# Altium project Antarty.PrjPcb
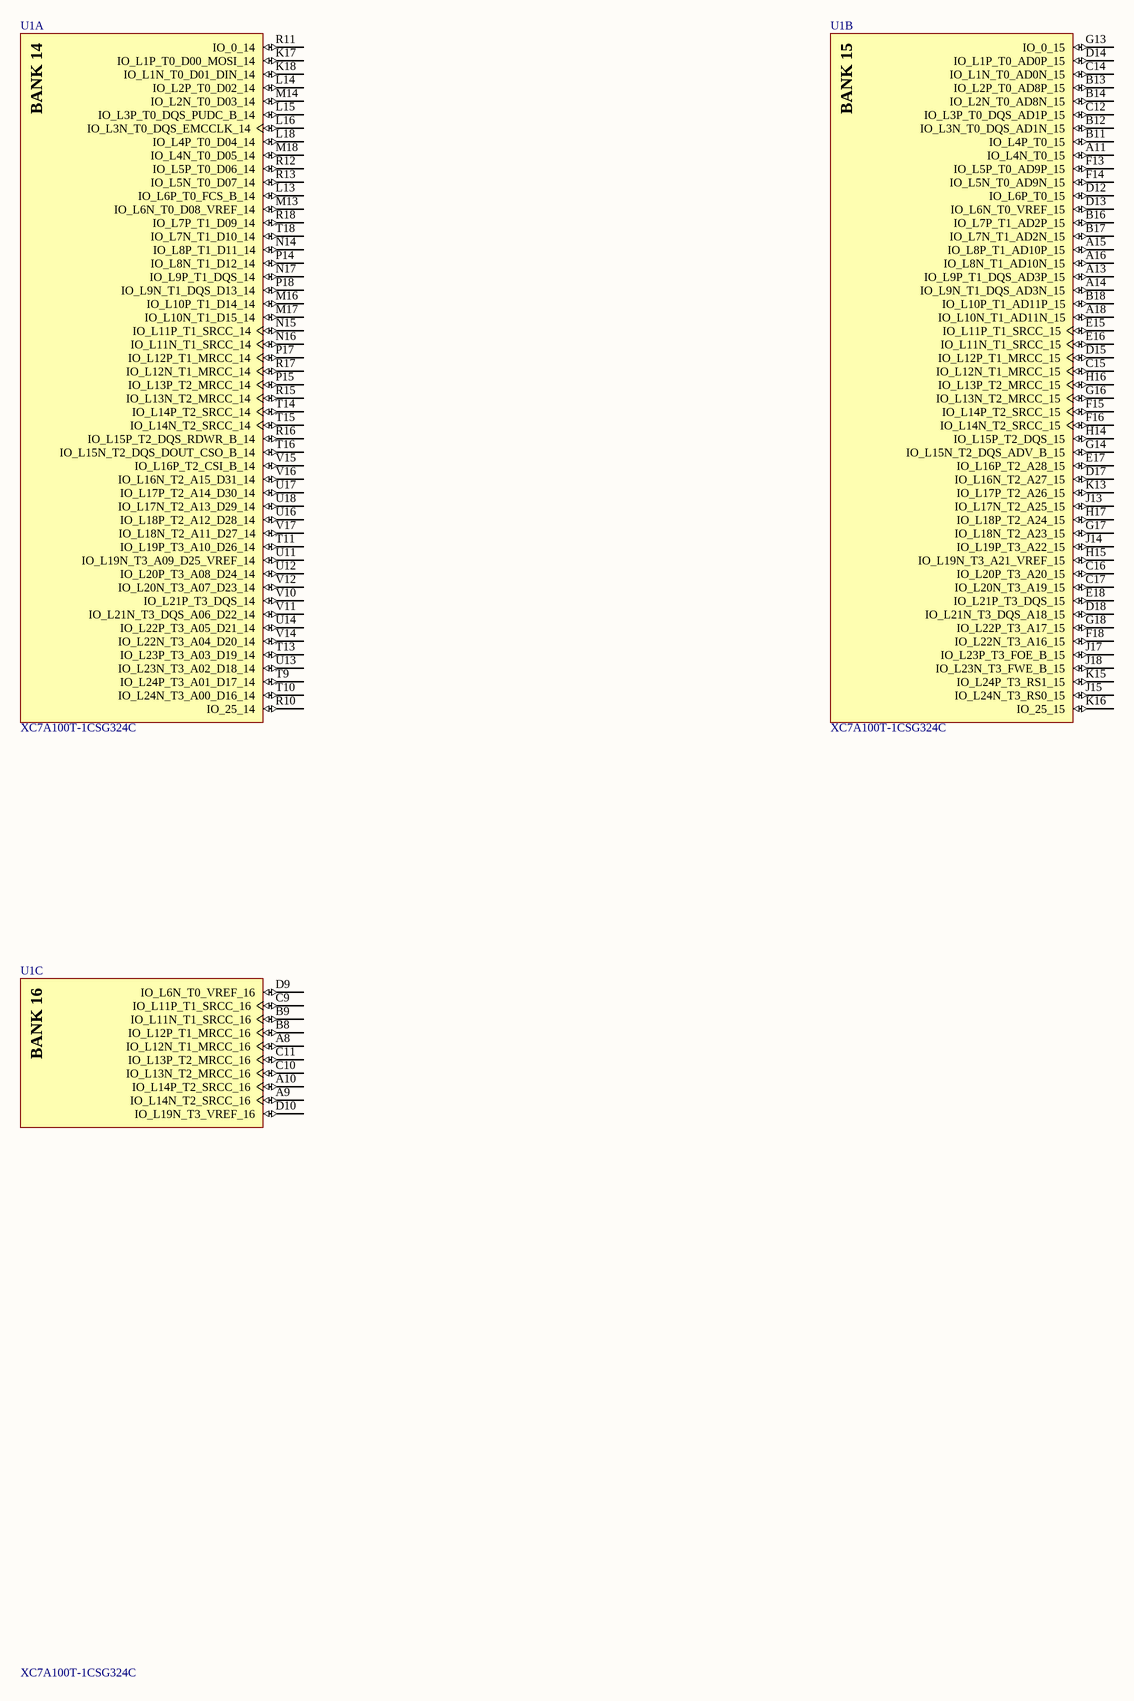
[diagram p0: Bank-1.SchDoc]
9 sheets, 1 parts. Net scope: global (net labels, ports and power ports of the same name join across sheets).
Board file: Board.PcbDoc
Sheets:
  Bank-1.SchDoc
  Bank-2.SchDoc
  Config-Flash.SchDoc
  Power.SchDoc
  Ethernet.SchDoc
  DDR3.SchDoc
  USB.SchDoc
  Power-Reg-1.SchDoc
  Power-Reg-2.SchDoc

## Sheet Bank-1.SchDoc: FPGA Banks
size A3; SheetNumber: 1; SheetTotal: 9

### Parts
U1  XC7A100T-1CSG324C  [CSG324]  (parts A,B,C of 9)

### Nets

Not connected (* = marked no-connect by the designer): U1 A8(IO_L12N_T1_MRCC_16) A9(IO_L14N_T2_SRCC_16) A10(IO_L14P_T2_SRCC_16) A11(IO_L4N_T0_15) A13(IO_L9P_T1_DQS_AD3P_15) A14(IO_L9N_T1_DQS_AD3N_15) A15(IO_L8P_T1_AD10P_15) A16(IO_L8N_T1_AD10N_15) A18(IO_L10N_T1_AD11N_15) B8(IO_L12P_T1_MRCC_16) B9(IO_L11N_T1_SRCC_16) B11(IO_L4P_T0_15) B12(IO_L3N_T0_DQS_AD1N_15) B13(IO_L2P_T0_AD8P_15) B14(IO_L2N_T0_AD8N_15) B16(IO_L7P_T1_AD2P_15) B17(IO_L7N_T1_AD2N_15) B18(IO_L10P_T1_AD11P_15) C9(IO_L11P_T1_SRCC_16) C10(IO_L13N_T2_MRCC_16) C11(IO_L13P_T2_MRCC_16) C12(IO_L3P_T0_DQS_AD1P_15) C14(IO_L1N_T0_AD0N_15) C15(IO_L12N_T1_MRCC_15) C16(IO_L20P_T3_A20_15) C17(IO_L20N_T3_A19_15) D9(IO_L6N_T0_VREF_16) D10(IO_L19N_T3_VREF_16) D12(IO_L6P_T0_15) D13(IO_L6N_T0_VREF_15) D14(IO_L1P_T0_AD0P_15) D15(IO_L12P_T1_MRCC_15) D17(IO_L16N_T2_A27_15) D18(IO_L21N_T3_DQS_A18_15) E15(IO_L11P_T1_SRCC_15) E16(IO_L11N_T1_SRCC_15) E17(IO_L16P_T2_A28_15) E18(IO_L21P_T3_DQS_15) F13(IO_L5P_T0_AD9P_15) F14(IO_L5N_T0_AD9N_15) F15(IO_L14P_T2_SRCC_15) F16(IO_L14N_T2_SRCC_15) F18(IO_L22N_T3_A16_15) G13(IO_0_15) G14(IO_L15N_T2_DQS_ADV_B_15) G16(IO_L13N_T2_MRCC_15) G17(IO_L18N_T2_A23_15) G18(IO_L22P_T3_A17_15) H14(IO_L15P_T2_DQS_15) H15(IO_L19N_T3_A21_VREF_15) H16(IO_L13P_T2_MRCC_15) H17(IO_L18P_T2_A24_15) J13(IO_L17N_T2_A25_15) J14(IO_L19P_T3_A22_15) J15(IO_L24N_T3_RS0_15) J17(IO_L23P_T3_FOE_B_15) J18(IO_L23N_T3_FWE_B_15) K13(IO_L17P_T2_A26_15) K15(IO_L24P_T3_RS1_15) K16(IO_25_15) K17(IO_L1P_T0_D00_MOSI_14) K18(IO_L1N_T0_D01_DIN_14) L13(IO_L6P_T0_FCS_B_14) L14(IO_L2P_T0_D02_14) L15(IO_L3P_T0_DQS_PUDC_B_14) L16(IO_L3N_T0_DQS_EMCCLK_14) L18(IO_L4P_T0_D04_14) M13(IO_L6N_T0_D08_VREF_14) M14(IO_L2N_T0_D03_14) M16(IO_L10P_T1_D14_14) M17(IO_L10N_T1_D15_14) M18(IO_L4N_T0_D05_14) N14(IO_L8P_T1_D11_14) N15(IO_L11P_T1_SRCC_14) N16(IO_L11N_T1_SRCC_14) N17(IO_L9P_T1_DQS_14) P14(IO_L8N_T1_D12_14) P15(IO_L13P_T2_MRCC_14) P17(IO_L12P_T1_MRCC_14) P18(IO_L9N_T1_DQS_D13_14) R10(IO_25_14) R11(IO_0_14) R12(IO_L5P_T0_D06_14) R13(IO_L5N_T0_D07_14) R15(IO_L13N_T2_MRCC_14) R16(IO_L15P_T2_DQS_RDWR_B_14) R17(IO_L12N_T1_MRCC_14) R18(IO_L7P_T1_D09_14) T9(IO_L24P_T3_A01_D17_14) T10(IO_L24N_T3_A00_D16_14) T11(IO_L19P_T3_A10_D26_14) T13(IO_L23P_T3_A03_D19_14) T14(IO_L14P_T2_SRCC_14) T15(IO_L14N_T2_SRCC_14) T16(IO_L15N_T2_DQS_DOUT_CSO_B_14) T18(IO_L7N_T1_D10_14) U11(IO_L19N_T3_A09_D25_VREF_14) U12(IO_L20P_T3_A08_D24_14) U13(IO_L23N_T3_A02_D18_14) U14(IO_L22P_T3_A05_D21_14) U16(IO_L18P_T2_A12_D28_14) U17(IO_L17P_T2_A14_D30_14) U18(IO_L17N_T2_A13_D29_14) V10(IO_L21P_T3_DQS_14) V11(IO_L21N_T3_DQS_A06_D22_14) V12(IO_L20N_T3_A07_D23_14) V14(IO_L22N_T3_A04_D20_14) V15(IO_L16P_T2_CSI_B_14) V16(IO_L16N_T2_A15_D31_14) V17(IO_L18N_T2_A11_D27_14)

### Notes on the sheet
- (in symbol CMP-016-00010-1, part A) BANK 14
- (in symbol CMP-016-00010-1, part B) BANK 15
- (in symbol CMP-016-00010-1, part C) BANK 16

### Library data of the parts
U1 = CMP-016-00010-1: Field Programmable Gate Array, 7925 CLBs, 1098MHz, 101440-Cell, PBGA324; Nominal Supply Voltage: 1V; Package Body Material: Plastic; Min Supply Voltage: 950mV; Max Supply Voltage: 1.05V; Number of Outputs: 210; Number of Logic Elements/Cells: 101440; Clock Frequency: 1.098GHz; Qualification Status: Not Qualified; Number of CLBs: 7925; Combinatorial Delay of a CLB-Max: 1.27ns; Terminal Finish: Copper; Moisture Sensitivity Level: 3; Terminal Position: BOTTOM; Max Operating Temperature: 85°C; Pins: 324; Case/Package: LFBGA; Number of Inputs: 210; Power Supplies: 1V; Height - Seated (Max): 1.5mm; Surface Mount: Yes; Package Style: GRID ARRAY, LOW PROFILE, FINE PITCHMeter; JESD-609 Code: e1; Reach SVHC Compliant: Yes; Programmable Logic Type: FIELD PROGRAMMABLE GATE ARRAY; Terminal Pitch: 0.8mm; Package Shape: Square; Width: 15mm; Terminal Form: Ball; Length: 15mm; RoHS Compliant: Yes; Temperature Grade: OTHER; Technology: CMOS; Min Operating Temperature: 0°C

## Sheet Bank-2.SchDoc
size A3; SheetNumber: 2; SheetTotal: 8
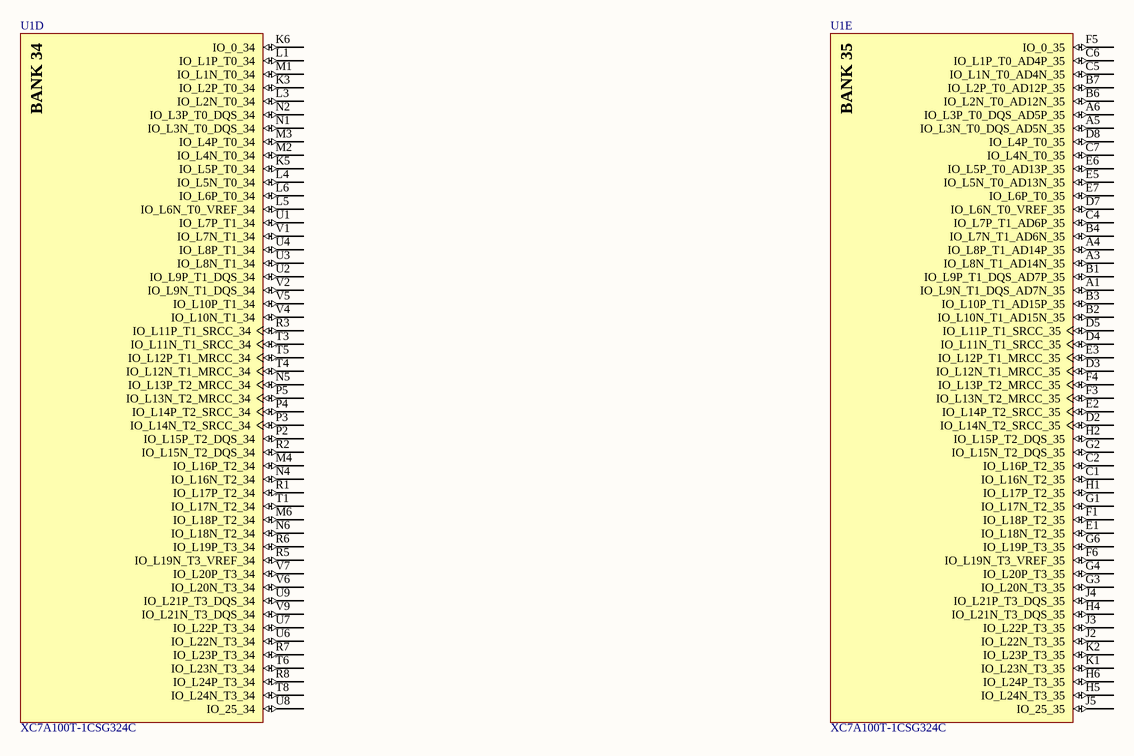
[diagram p1: Bank-2.SchDoc]

### Parts
U1  XC7A100T-1CSG324C  [CSG324]  (parts D,E of 9)

### Nets

Not connected (* = marked no-connect by the designer): U1 A1(IO_L9N_T1_DQS_AD7N_35) A3(IO_L8N_T1_AD14N_35) A4(IO_L8P_T1_AD14P_35) A5(IO_L3N_T0_DQS_AD5N_35) A6(IO_L3P_T0_DQS_AD5P_35) B1(IO_L9P_T1_DQS_AD7P_35) B2(IO_L10N_T1_AD15N_35) B3(IO_L10P_T1_AD15P_35) B4(IO_L7N_T1_AD6N_35) B6(IO_L2N_T0_AD12N_35) B7(IO_L2P_T0_AD12P_35) C1(IO_L16N_T2_35) C2(IO_L16P_T2_35) C4(IO_L7P_T1_AD6P_35) C5(IO_L1N_T0_AD4N_35) C6(IO_L1P_T0_AD4P_35) C7(IO_L4N_T0_35) D2(IO_L14N_T2_SRCC_35) D3(IO_L12N_T1_MRCC_35) D4(IO_L11N_T1_SRCC_35) D5(IO_L11P_T1_SRCC_35) D7(IO_L6N_T0_VREF_35) D8(IO_L4P_T0_35) E1(IO_L18N_T2_35) E2(IO_L14P_T2_SRCC_35) E3(IO_L12P_T1_MRCC_35) E5(IO_L5N_T0_AD13N_35) E6(IO_L5P_T0_AD13P_35) E7(IO_L6P_T0_35) F1(IO_L18P_T2_35) F3(IO_L13N_T2_MRCC_35) F4(IO_L13P_T2_MRCC_35) F5(IO_0_35) F6(IO_L19N_T3_VREF_35) G1(IO_L17N_T2_35) G2(IO_L15N_T2_DQS_35) G3(IO_L20N_T3_35) G4(IO_L20P_T3_35) G6(IO_L19P_T3_35) H1(IO_L17P_T2_35) H2(IO_L15P_T2_DQS_35) H4(IO_L21N_T3_DQS_35) H5(IO_L24N_T3_35) H6(IO_L24P_T3_35) J2(IO_L22N_T3_35) J3(IO_L22P_T3_35) J4(IO_L21P_T3_DQS_35) J5(IO_25_35) K1(IO_L23N_T3_35) K2(IO_L23P_T3_35) K3(IO_L2P_T0_34) K5(IO_L5P_T0_34) K6(IO_0_34) L1(IO_L1P_T0_34) L3(IO_L2N_T0_34) L4(IO_L5N_T0_34) L5(IO_L6N_T0_VREF_34) L6(IO_L6P_T0_34) M1(IO_L1N_T0_34) M2(IO_L4N_T0_34) M3(IO_L4P_T0_34) M4(IO_L16P_T2_34) M6(IO_L18P_T2_34) N1(IO_L3N_T0_DQS_34) N2(IO_L3P_T0_DQS_34) N4(IO_L16N_T2_34) N5(IO_L13P_T2_MRCC_34) N6(IO_L18N_T2_34) P2(IO_L15P_T2_DQS_34) P3(IO_L14N_T2_SRCC_34) P4(IO_L14P_T2_SRCC_34) P5(IO_L13N_T2_MRCC_34) R1(IO_L17P_T2_34) R2(IO_L15N_T2_DQS_34) R3(IO_L11P_T1_SRCC_34) R5(IO_L19N_T3_VREF_34) R6(IO_L19P_T3_34) R7(IO_L23P_T3_34) R8(IO_L24P_T3_34) T1(IO_L17N_T2_34) T3(IO_L11N_T1_SRCC_34) T4(IO_L12N_T1_MRCC_34) T5(IO_L12P_T1_MRCC_34) T6(IO_L23N_T3_34) T8(IO_L24N_T3_34) U1(IO_L7P_T1_34) U2(IO_L9P_T1_DQS_34) U3(IO_L8N_T1_34) U4(IO_L8P_T1_34) U6(IO_L22N_T3_34) U7(IO_L22P_T3_34) U8(IO_25_34) U9(IO_L21P_T3_DQS_34) V1(IO_L7N_T1_34) V2(IO_L9N_T1_DQS_34) V4(IO_L10N_T1_34) V5(IO_L10P_T1_34) V6(IO_L20N_T3_34) V7(IO_L20P_T3_34) V9(IO_L21N_T3_DQS_34)

### Notes on the sheet
- (in symbol CMP-016-00010-1, part D) BANK 34
- (in symbol CMP-016-00010-1, part E) BANK 35

### Library data of the parts
U1 = CMP-016-00010-1: as U1 on sheet Bank-1; Terminal Finish: Copper; Moisture Sensitivity Level: 3; Terminal Position: BOTTOM; Max Operating Temperature: 85°C; Pins: 324; Case/Package: LFBGA; Number of Inputs: 210; Power Supplies: 1V; Height - Seated (Max): 1.5mm; Surface Mount: Yes; Package Style: GRID ARRAY, LOW PROFILE, FINE PITCHMeter; JESD-609 Code: e1; Reach SVHC Compliant: Yes; Programmable Logic Type: FIELD PROGRAMMABLE GATE ARRAY; Terminal Pitch: 0.8mm; Package Shape: Square; Width: 15mm; Terminal Form: Ball; Length: 15mm; RoHS Compliant: Yes; Temperature Grade: OTHER; Technology: CMOS; Min Operating Temperature: 0°C

## Sheet Config-Flash.SchDoc
size A3; SheetNumber: 3; SheetTotal: 7
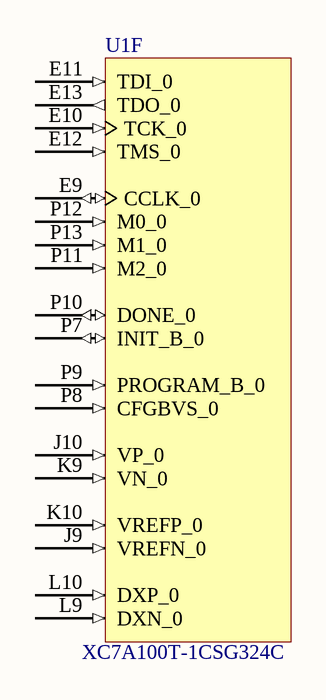
[diagram p2: Config-Flash.SchDoc]

### Parts
U1  XC7A100T-1CSG324C  [CSG324]  (part F of 9)

### Nets

Not connected (* = marked no-connect by the designer): U1 E9(CCLK_0) E10(TCK_0) E11(TDI_0) E12(TMS_0) E13(TDO_0) J9(VREFN_0) J10(VP_0) K9(VN_0) K10(VREFP_0) L9(DXN_0) L10(DXP_0) P7(INIT_B_0) P8(CFGBVS_0) P9(PROGRAM_B_0) P10(DONE_0) P11(M2_0) P12(M0_0) P13(M1_0)

### Library data of the parts
U1 = CMP-016-00010-1: as U1 on sheet Bank-1; Terminal Finish: Copper; Moisture Sensitivity Level: 3; Terminal Position: BOTTOM; Max Operating Temperature: 85°C; Pins: 324; Case/Package: LFBGA; Number of Inputs: 210; Power Supplies: 1V; Height - Seated (Max): 1.5mm; Surface Mount: Yes; Package Style: GRID ARRAY, LOW PROFILE, FINE PITCHMeter; JESD-609 Code: e1; Reach SVHC Compliant: Yes; Programmable Logic Type: FIELD PROGRAMMABLE GATE ARRAY; Terminal Pitch: 0.8mm; Package Shape: Square; Width: 15mm; Terminal Form: Ball; Length: 15mm; RoHS Compliant: Yes; Temperature Grade: OTHER; Technology: CMOS; Min Operating Temperature: 0°C

## Sheet Power.SchDoc
size A3; SheetNumber: 4; SheetTotal: 7
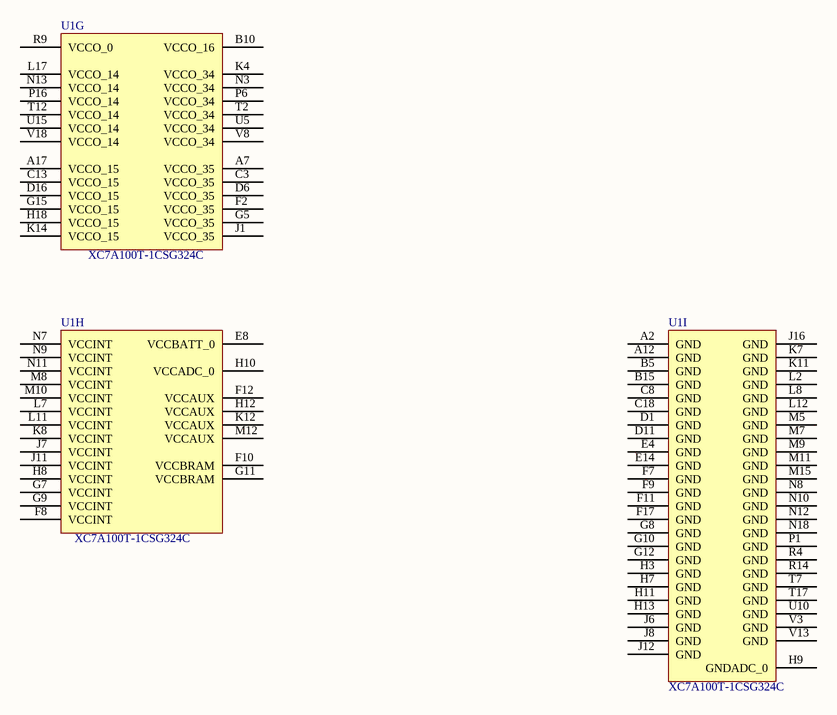
[diagram p3: Power.SchDoc]

### Parts
U1  XC7A100T-1CSG324C  [CSG324]  (parts G,H,I of 9)

### Nets

Not connected (* = marked no-connect by the designer): U1 A2(GND) A7(VCCO_35) A12(GND) A17(VCCO_15) B5(GND) B10(VCCO_16) B15(GND) C3(VCCO_35) C8(GND) C13(VCCO_15) C18(GND) D1(GND) D6(VCCO_35) D11(GND) D16(VCCO_15) E4(GND) E8(VCCBATT_0) E14(GND) F2(VCCO_35) F7(GND) F8(VCCINT) F9(GND) F10(VCCBRAM) F11(GND) F12(VCCAUX) F17(GND) G5(VCCO_35) G7(VCCINT) G8(GND) G9(VCCINT) G10(GND) G11(VCCBRAM) G12(GND) G15(VCCO_15) H3(GND) H7(GND) H8(VCCINT) H9(GNDADC_0) H10(VCCADC_0) H11(GND) H12(VCCAUX) H13(GND) H18(VCCO_15) J1(VCCO_35) J6(GND) J7(VCCINT) J8(GND) J11(VCCINT) J12(GND) J16(GND) K4(VCCO_34) K7(GND) K8(VCCINT) K11(GND) K12(VCCAUX) K14(VCCO_15) L2(GND) L7(VCCINT) L8(GND) L11(VCCINT) L12(GND) L17(VCCO_14) M5(GND) M7(GND) M8(VCCINT) M9(GND) M10(VCCINT) M11(GND) M12(VCCAUX) M15(GND) N3(VCCO_34) N7(VCCINT) N8(GND) N9(VCCINT) N10(GND) N11(VCCINT) N12(GND) N13(VCCO_14) N18(GND) P1(GND) P6(VCCO_34) P16(VCCO_14) R4(GND) R9(VCCO_0) R14(GND) T2(VCCO_34) T7(GND) T12(VCCO_14) T17(GND) U5(VCCO_34) U10(GND) U15(VCCO_14) V3(GND) V8(VCCO_34) V13(GND) V18(VCCO_14)

### Library data of the parts
U1 = CMP-016-00010-1: as U1 on sheet Bank-1; Terminal Finish: Copper; Moisture Sensitivity Level: 3; Terminal Position: BOTTOM; Max Operating Temperature: 85°C; Pins: 324; Case/Package: LFBGA; Number of Inputs: 210; Power Supplies: 1V; Height - Seated (Max): 1.5mm; Surface Mount: Yes; Package Style: GRID ARRAY, LOW PROFILE, FINE PITCHMeter; JESD-609 Code: e1; Reach SVHC Compliant: Yes; Programmable Logic Type: FIELD PROGRAMMABLE GATE ARRAY; Terminal Pitch: 0.8mm; Package Shape: Square; Width: 15mm; Terminal Form: Ball; Length: 15mm; RoHS Compliant: Yes; Temperature Grade: OTHER; Technology: CMOS; Min Operating Temperature: 0°C

## Sheet Ethernet.SchDoc
size A3; SheetNumber: 5; SheetTotal: 7

## Sheet DDR3.SchDoc
size A3; SheetNumber: 6; SheetTotal: 7

## Sheet USB.SchDoc
size A3; SheetNumber: 7; SheetTotal: 7

## Sheet Power-Reg-1.SchDoc
size A3; SheetNumber: 8; SheetTotal: 9

## Sheet Power-Reg-2.SchDoc
size A3; SheetNumber: 9; SheetTotal: 9